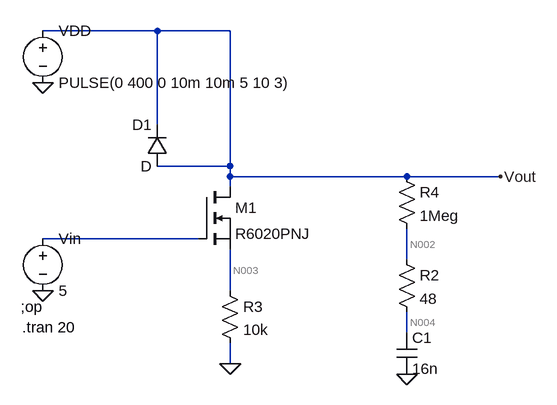
[diagram p0: schematic 20201108 - Driving Circuit Simulation.asc]
20201108 - Driving Circuit Simulation.asc, the LTspice schematic file:
Version 4
SHEET 1 880 680
WIRE 48 -192 -128 -192
WIRE 160 -192 48 -192
WIRE 48 -48 48 -192
WIRE 160 16 160 -192
WIRE 160 16 48 16
WIRE 160 32 160 16
WIRE 432 32 160 32
WIRE 576 32 432 32
WIRE 160 48 160 32
WIRE 112 128 -128 128
WIRE 432 160 432 112
WIRE 160 208 160 144
WIRE 432 272 432 240
WIRE 160 320 160 288
FLAG 160 320 0
FLAG -128 -112 0
FLAG -128 208 0
FLAG 576 32 Vout
FLAG 432 336 0
SYMBOL voltage -128 112 R0
WINDOW 123 0 0 Left 0
WINDOW 39 0 0 Left 0
SYMATTR InstName Vin
SYMATTR Value 5
SYMBOL voltage -128 -208 R0
WINDOW 123 0 0 Left 0
WINDOW 39 0 0 Left 0
SYMATTR InstName VDD
SYMATTR Value PULSE(0 400 0 10m 10m 5 10 3)
SYMBOL nmos 112 48 R0
SYMATTR InstName M1
SYMATTR Value R6020PNJ
SYMBOL res 416 144 R0
SYMATTR InstName R2
SYMATTR Value 48
SYMBOL res 144 192 R0
SYMATTR InstName R3
SYMATTR Value 10k
SYMBOL diode 64 16 R180
WINDOW 0 24 64 Left 2
WINDOW 3 24 0 Left 2
SYMATTR InstName D1
SYMBOL res 416 16 R0
SYMATTR InstName R4
SYMATTR Value 1Meg
SYMBOL cap 416 272 R0
SYMATTR InstName C1
SYMATTR Value 16n
TEXT -162 232 Left 2 !;op
TEXT -160 264 Left 2 !.tran 20

The netlist it stands for:
* 20201108 - Driving Circuit Simulation.asc
Vin N001 0 5
VDD Vout 0 PULSE(0 400 0 10m 10m 5 10 3)
M1 Vout N001 N003 N003 R6020PNJ
R2 N002 N004 48
R3 N003 0 10k
D1 Vout Vout D
R4 Vout N002 1Meg
C1 N004 0 16n
.model D D
.lib standard.dio
.model NMOS NMOS
.model PMOS PMOS
.lib standard.mos
;op
.tran 20
.backanno
.end

* Results of the author's LTspice run, read from the files saved beside the schematic
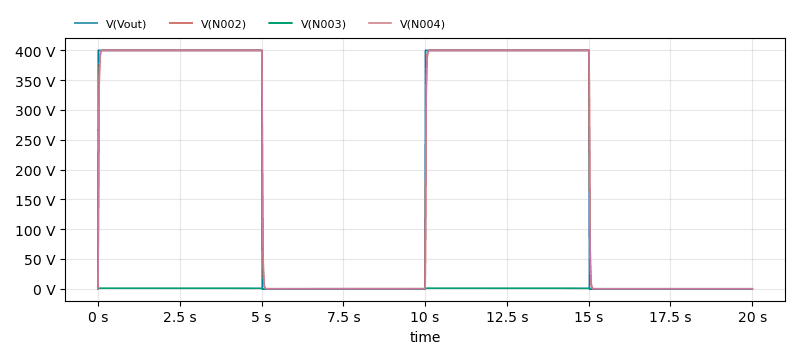
[diagram p1: Transient Analysis of 20201108 - Driving Circuit Simulation.asc, plotted from the saved traces]
* Transient Analysis, 1 run:
*   V(Vout): min 0 V, max 400 V, average 200.4 V, rms 283 V, last 0 V
*   V(N002): min 0 V, max 400 V, average 200.4 V, rms 282.6 V, last 0 V
*   V(N003): min 0 V, max 1.509 V, average 523.8 mV, rms 739.2 mV, last 0 V
*   V(N004): min 0 V, max 400 V, average 200.4 V, rms 282.6 V, last 0 V